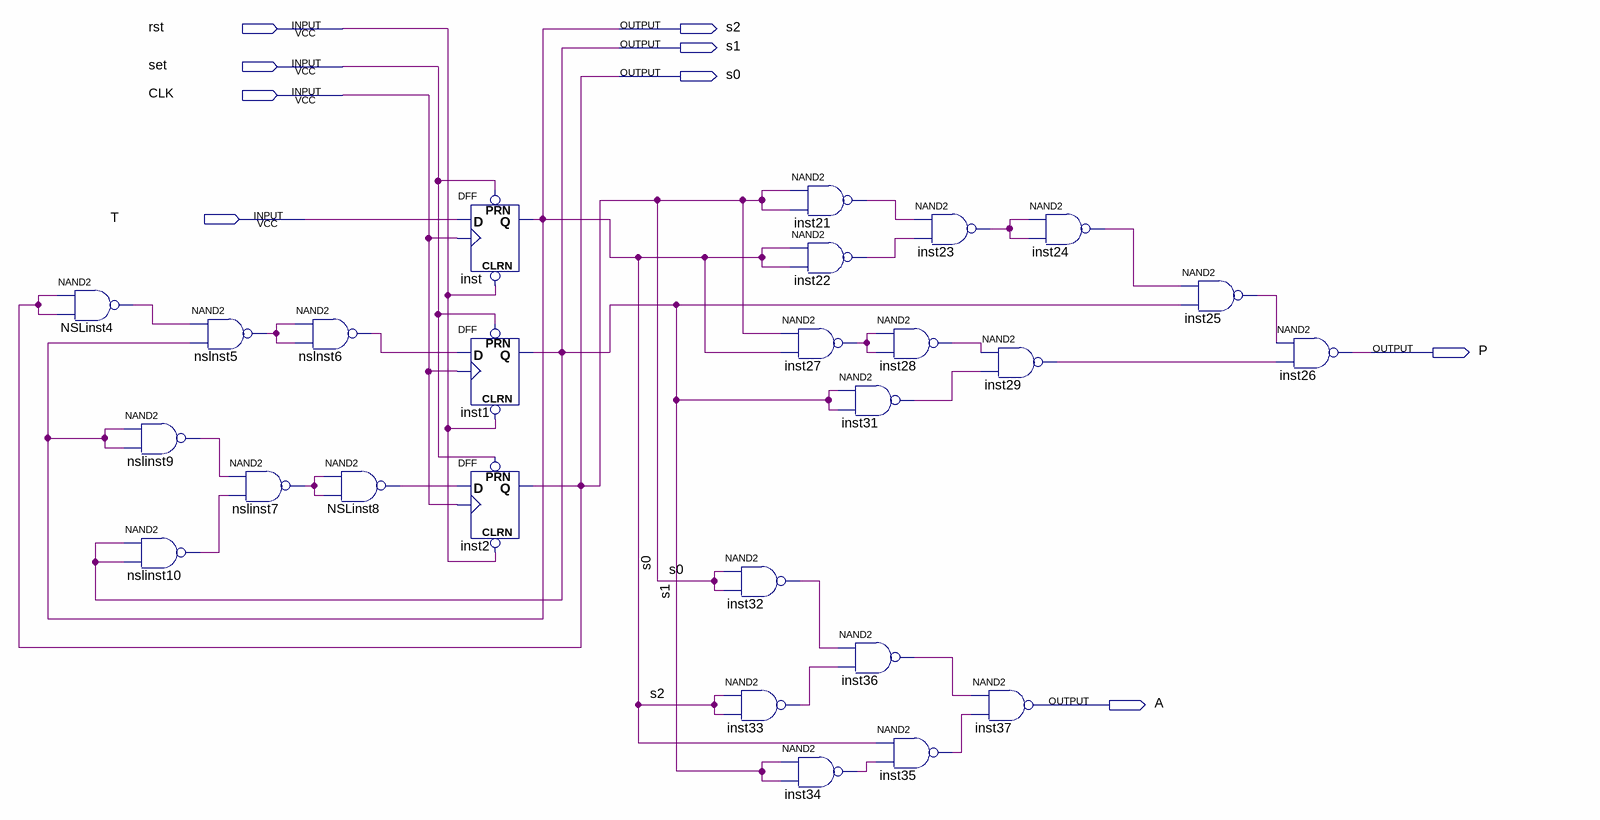
[diagram p0: schematic sheet]
// Quartus schematic Lab7Extension.bdf as structural Verilog: 26 symbols, 9 pins
module Lab7Extension (
  input  rst,
  input  set,
  input  CLK,
  input  T,
  output s2,
  output s1,
  output s0,
  output P,
  output A
);

  wire inst21_out, inst22_out, inst23_out, inst24_out, inst25_out, inst27_out, inst28_out, inst29_out,
       inst31_out, inst32_out, inst33_out, inst34_out, inst35_out, inst36_out, NSLinst4_out, nslinst7_out,
       NSLinst8_out, nslinst9_out, nslinst10_out, nslnst5_out, nslnst6_out;

  nand NSLinst4 (NSLinst4_out, s0, s0);
  nand nslinst9 (nslinst9_out, s2, s2);
  nand nslinst10 (nslinst10_out, s1, s1);
  nand nslnst5 (nslnst5_out, NSLinst4_out, s2);
  nand nslinst7 (nslinst7_out, nslinst9_out, nslinst10_out);
  nand nslnst6 (nslnst6_out, nslnst5_out, nslnst5_out);
  nand NSLinst8 (NSLinst8_out, nslinst7_out, nslinst7_out);
  DFF inst (.CLRN(rst), .CLK(CLK), .D(T), .PRN(set), .Q(s2));
  DFF inst1 (.CLRN(rst), .CLK(CLK), .D(nslnst6_out), .PRN(set), .Q(s1));
  DFF inst2 (.CLRN(rst), .CLK(CLK), .D(NSLinst8_out), .PRN(set), .Q(s0));
  nand inst32 (inst32_out, s0, s0);
  nand inst33 (inst33_out, s2, s2);
  nand inst21 (inst21_out, s0, s0);
  nand inst22 (inst22_out, s2, s2);
  nand inst27 (inst27_out, s0, s2);
  nand inst31 (inst31_out, s1, s1);
  nand inst36 (inst36_out, inst32_out, inst33_out);
  nand inst34 (inst34_out, s1, s1);
  nand inst23 (inst23_out, inst21_out, inst22_out);
  nand inst28 (inst28_out, inst27_out, inst27_out);
  nand inst35 (inst35_out, s2, inst34_out);
  nand inst29 (inst29_out, inst28_out, inst31_out);
  nand inst37 (A, inst36_out, inst35_out);
  nand inst24 (inst24_out, inst23_out, inst23_out);
  nand inst25 (inst25_out, inst24_out, s1);
  nand inst26 (P, inst25_out, inst29_out);
endmodule
